# EasyEDA Pro project ProProject_STM32F407IGT6_2024-02-27.epro, schematic Schematic3
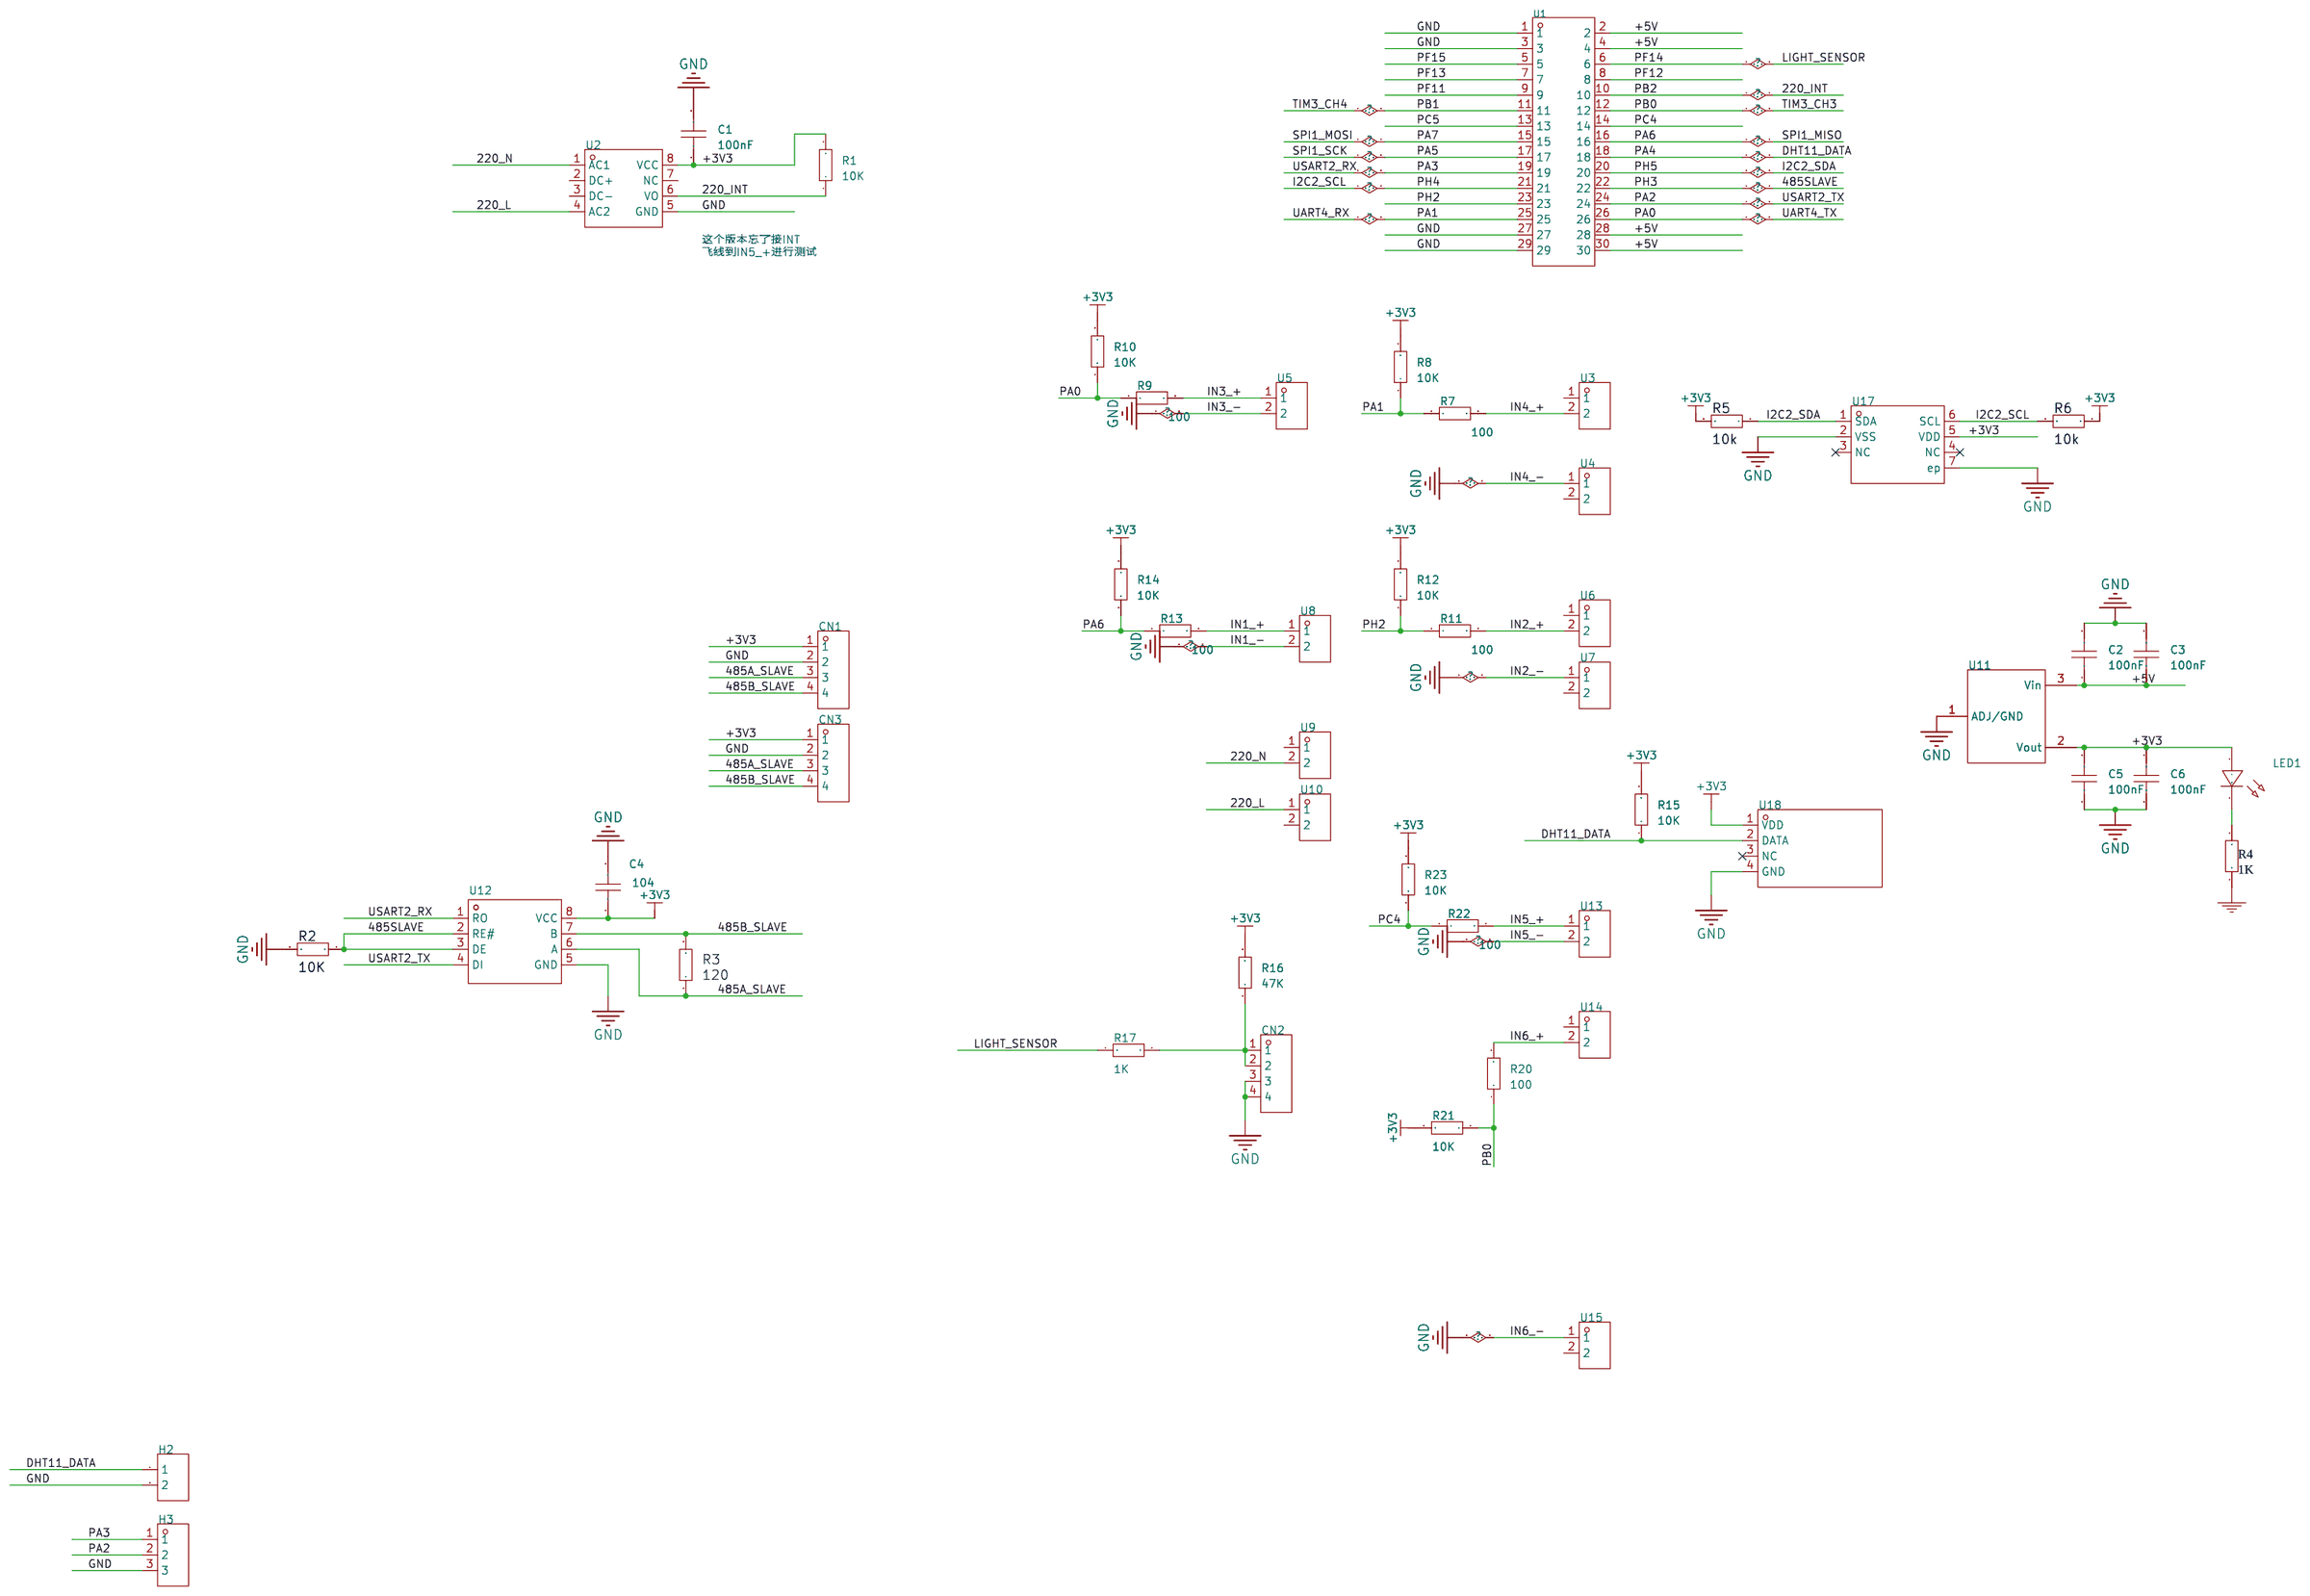
[diagram p3: schematic sheet]

## Parts
C1  100nF  [C0805]
C2  100nF  [C0805]
C3  100nF  [C0805]
C4  104  [C0805]
C5  100nF  [C0805]
C6  100nF  [C0805]
CN1  HC-5264-4A  [CONN-TH_4P-P2.50_HCTL_HC-5264-4A]
CN2  XH-4AK  [CONN-TH_XH-4AK]
CN3  HC-5264-4A  [CONN-TH_4P-P2.50_HCTL_HC-5264-4A]
H2  -  [HDR-TH_2P-P2.54-V-F]
H3  -  [HDR-TH_3P-P2.54-V-F]
LED1  -  [LED0805-RD_RED]
R1  10K  [R0805]
R2  10K  [R0805]
R3  120  [R0805]
R4  1K  [R0805]
R5  10k  [R0805]
R6  10k  [R0805]
R7  100  [R0805]
R8  10K  [R0805]
R9  100  [R0805]
R10  10K  [R0805]
R11  100  [R0805]
R12  10K  [R0805]
R13  100  [R0805]
R14  10K  [R0805]
R15  10K  [R0805]
R16  47K  [R0805]
R17  1K  [R0805]
R20  100  [R0805]
R21  10K  [R0805]
R22  100  [R0805]
R23  10K  [R0805]
U1  ZX-IDC2.54-2-15PZZ  [IDC-TH_30P-P2.54_ZX-IDC2.54-2-15PZZ]
U2  ACPL-K370-500E  [SO-8_L5.9-W6.8-P1.27-LS11.5-BL]
U3  KF7.62-2P  [CONN-TH_2P-P7.62_KEFA_KF7.62-2P]
U4  KF7.62-2P  [CONN-TH_2P-P7.62_KEFA_KF7.62-2P]
U5  KF7.62-2P  [CONN-TH_2P-P7.62_KEFA_KF7.62-2P]
U6  KF7.62-2P  [CONN-TH_2P-P7.62_KEFA_KF7.62-2P]
U7  KF7.62-2P  [CONN-TH_2P-P7.62_KEFA_KF7.62-2P]
U8  KF7.62-2P  [CONN-TH_2P-P7.62_KEFA_KF7.62-2P]
U9  KF7.62-2P  [CONN-TH_2P-P7.62_KEFA_KF7.62-2P]
U10  KF7.62-2P  [CONN-TH_2P-P7.62_KEFA_KF7.62-2P]
U11  UZ1085L-33-TN3-R  [TO-252-2_L6.6-W6.1-P4.58-TL]
U12  MAX3485EESA+T  [SOIC-8_L4.9-W3.9-P1.27-LS6.0-BL]
U13  KF7.62-2P  [CONN-TH_2P-P7.62_KEFA_KF7.62-2P]
U14  KF7.62-2P  [CONN-TH_2P-P7.62_KEFA_KF7.62-2P]
U15  KF7.62-2P  [CONN-TH_2P-P7.62_KEFA_KF7.62-2P]
U17  SHT20-TR-1.5KS  [DFN-6_L3.0-W3.0-P0.95-TR-EP]
U18  DHT11  [SENSOR-TH_DHT11]

## Library data of the parts
C1-C3 C5 C6 = CAP_0805: Supplier Footprint: 0805
C4 = CAP_0805: 容值:100nF;精度:±10%;额定电压:50V;温度系数:X7R;; Supplier Footprint: 0805
CN1 CN3 = HC-5264-4A: 插针结构:1x4P;间距:2.5mm;安装方式:直插;行距:-;总PIN数:4P;排数:1;每排PIN数:4;参考系列:-;额定电流:3A;工作温度范围:-25℃~+85℃;; LCSC Part Name: 1x4P 间距:2.5mm 直插; Supplier Part: C2845816; Manufacturer: HCTL(华灿天禄); Supplier Footprint: 插件,P=2.5mm; JLCPCB Part Class: 扩展库; Datasheet: https://atta.szlcsc.com/upload/public/pdf/source/20231019/713AA42E7B1E6A6BC6D4E561F769D95F.pdf; Supplier: LCSC; Pins Structure: 1x4P; Pitch: 2.5mm; Mounting Style: 直插; Number of Pins: 4P; Number of Rows: 1; Number of PINs Per Row: 4; Current Rating (Max): 3A; Operating Temperature Range: -25℃~+85℃
CN2 = XH-4AK: 插针结构:1x4P;间距:2.5mm;公母:公;安装方式:直插;行距:-;排数:1;每排PIN数:4;参考系列:-;额定电流:2A;工作温度范围:-25℃~+85℃;; LCSC Part Name: 1x4P 间距:2.5mm 直插; Supplier Part: C722871; Manufacturer: CAX(创都); Supplier Footprint: 插件,P=2.5mm; JLCPCB Part Class: Extended Part; Datasheet: https://atta.szlcsc.com/upload/public/pdf/source/20200903/C722871_BEC659A202DD5B5008316291EC89367F.pdf; Supplier: LCSC; Pins Structure: 1x4P; Pitch: 2.5mm; Gender: 公; Mounting Style: 直插; Number of Rows: 1; Number of PINs Per Row: 4; Current Rating (Max): 2A; Operating Temperature Range: -25℃~+85℃
H2 = HDR-F_2.54_1x2P: Supplier Part: C49661; Supplier Footprint: 插件
H3 = HDR-F_2.54_1x3P: Supplier Part: C541850; Supplier Footprint: 插件
LED1 = LED_0805-G: Supplier Footprint: 0805
R1 R7-R17 R20-R23 = Res_0805: Supplier Footprint: 0805
R2 R3 R5 R6 = 10K
R4 = 1K: Published: 8-Jun-2000; LatestRevisionDate: 17-Jul-2002; LatestRevisionNote: Re-released for DXP Platform.; PackageReference: AXIAL-0.4; Publisher: Altium Limited
U1 = ZX-IDC2.54-2-15PZZ: 连接器类型:简牛座;间距:2.54mm;结构:2x15P;额定电流:3A;额定电压:1kV;封装形式:直插;行距:2.54mm;排数:2;每排PIN数:15;触头材质:黄铜;触头镀层:金;工作温度范围:-40℃~+105℃;焊接温度(最大值):260℃@10S;; LCSC Part Name: 2.54mm 2x15P 排数:2 每排P数:15; Supplier Part: C7501248; Manufacturer: Megastar(兆星); Supplier Footprint: 插件,P=2.54mm; Datasheet: https://atta.szlcsc.com/upload/public/pdf/source/20231122/459F800AA0F2D58DBB272BCD842D4D41.pdf; Supplier: LCSC; Connector Type: 简牛座; Pitch: 2.54mm; Structure: 2x15P; Current Rating (Max): 3A; Voltage Rating (Max): 1kV; Holder Type: 直插; Row Spacing: 2.54mm; Number of Rows: 2; Pin Number in each Row: 15; Contact Material: 黄铜; Contact Plating: 金; Operating Temperature Range: -40℃~+105℃; Soldering Temperature(Max): 260℃@10S
U2 = ACPL-K370-500E: LCSC Part Name: Isolated Voltage/Current Detector; Supplier Part: C2977813; Manufacturer: Broadcom/AVAGO(安华高); Supplier Footprint: SO-8-6.8mm; JLCPCB Part Class: 扩展库; Datasheet: https://atta.szlcsc.com/upload/public/pdf/source/20220511/AB075B21B9194CFAB4C51F88C093740A.pdf; Supplier: LCSC
U3-U10 U13-U15 = KF7.62-2P_C5173665: LCSC Part Name: 绿色尼龙环保; Supplier Part: C5173665; Manufacturer: KEFA(科发); Supplier Footprint: 插件,P=7.62mm; JLCPCB Part Class: Extended Part; Datasheet: https://atta.szlcsc.com/upload/public/pdf/source/20220915/0842C98F0805CE3BBD42ED115252704B.pdf; Supplier: LCSC
U11 = UZ1085L-33-TN3-R: 输出类型:固定;最大输入电压:18V;输出电压:3.3V;最大输出电流:3A;电源纹波抑制比(PSRR):72dB@(120Hz);输出极性:正极;; LCSC Part Name: 输入18V 输出3.3V 3A; Supplier Part: C125622; Manufacturer: UTC(友顺); Supplier Footprint: TO-252-2(DPAK); JLCPCB Part Class: 扩展库; Datasheet: https://atta.szlcsc.com/upload/public/pdf/source/20180905/C281745_F796DDBD7FDDF6134D37DF1C5154ADDE.pdf; Supplier: LCSC; Output Type: 固定; Maximum Input Voltage: 18V; Output Voltage: 3.3V; MAX Output Current: 3A; Power Supply Rejection Ratio (PSRR): 72dB@(120Hz); Dropout Voltage: 1.4V@(3A); Output Polarity: 正极; Number of Outputs: 1
U12 = MAX3485EESA+T: 类型:收发器;驱动器/接收器:1/1;数据速率:12Mbps;; LCSC Part Name: 3.3V供电 12Mbps 收发器; Supplier Part: C9943; Manufacturer: ADI(亚德诺)/MAXIM(美信); Supplier Footprint: SOP-8; JLCPCB Part Class: Extended Part; Datasheet: https://atta.szlcsc.com/upload/public/pdf/source/20121117/1457706559058.pdf; Supplier: LCSC; Types: 收发器; Driver/receiver: 1/1; Data Rate: 12Mbps; Supply Voltage: 3V~3.6V; Operating Temperature: -40℃~+85℃
U17 = SHT20-TR-1.5KS: 1-100706-01, I2C接口，数字式温湿度传感器，电压范围: 2.1至3.6 V; Supplier Part: C53865; Manufacturer: Sensirion(瑞士盛思锐); Supplier Footprint: DFN-6-EP(3x3); JLCPCB Part Class: 扩展库; Datasheet: https://atta.szlcsc.com/upload/public/pdf/source/20151012/1457707445424.pdf; Supplier: LCSC
U18 = DHT11: 新款电容式数字温湿度传感器,老款已停产16.1x12.6x5.8mm; LCSC Part Name: DHT11  电容式传感器; Supplier Part: C117051; Manufacturer: 广州奥松; Supplier Footprint: SIP-4; JLCPCB Part Class: 扩展库; Datasheet: https://atta.szlcsc.com/upload/public/pdf/source/20170703/1499081238365.pdf; Supplier: LCSC

## Nets
+3V3: C1.1 C4.1 C5.2 C6.2 CN1.1 CN3.1 LED1.2(A) R1.2 R5.2 R6.2 R8.2 R10.2 R12.2 R14.2 R15.2 R16.2 R21.2 R23.2 U2.8(VCC) U11.2(Vout) U12.8(VCC) U17.5(VDD) U18.1(VDD)
+5V: C2.1 C3.1 U1.2 U1.4 U1.28 U1.30 U11.3(Vin)
GND: C1.2 C2.2 C3.2 C4.2 C5.1 C6.1 CN1.2 CN2.3 CN2.4 CN3.2 H2.2 H3.3 R2.1 R4.2 U1.1 U1.3 U1.27 U1.29 U2.5(GND) U4.1 U5.2 U7.1 U8.2 U11.1(ADJ/GND) U12.5(GND) U13.2 U15.1 U17.2(VSS) U17.7(ep) U18.4(GND)
220_INT: R1.1 U1.10 U2.6(VO)
220_L: U2.4(AC2) U10.1
220_N: U2.1(AC1) U9.2
485A_SLAVE: CN1.3 CN3.3 R3.1 U12.6(A)
485B_SLAVE: CN1.4 CN3.4 R3.2 U12.7(B)
485SLAVE: R2.2 U1.22 U12.2(RE#) U12.3(DE)
DHT11_DATA: H2.1 R15.1 U1.18 U18.2(DATA)
I2C2_SCL: R6.1 U1.21 U17.6(SCL)
I2C2_SDA: R5.1 U1.20 U17.1(SDA)
IN1_+: R13.2 U8.1
IN2_+: R11.2 U6.2
IN3_+: R9.2 U5.1
IN4_+: R7.2 U3.2
IN5_+: R22.2 U13.1
IN6_+: R20.2 U14.2
LIGHT_SENSOR: R17.2 U1.6
PA0: R9.1 R10.1 U1.26
PA1: R7.1 R8.1 U1.25
PA2: H3.2 U1.24 U12.4(DI)
PA3: H3.1 U1.19 U12.1(RO)
PA5: U1.17
PA6: R13.1 R14.1 U1.16
PA7: U1.15
PB0: R20.1 R21.1 U1.12
PB1: U1.11
PC4: R22.1 R23.1 U1.14
PC5: U1.13
PF11: U1.9
PF12: U1.8
PF13: U1.7
PF15: U1.5
PH2: R11.1 R12.1 U1.23
$1N5460: LED1.1(C) R4.1
$1N7734: CN2.1 CN2.2 R16.1 R17.1

Not connected (* = marked no-connect by the designer): U2 2(DC+) 3(DC-) 7(NC); U3 1; U4 2; U6 1; U7 2; U9 1; U10 2; U14 1; U15 2; U17 3(NC)* 4(NC)*; U18 3(NC)*

## Notes on the sheet
- 这个版本忘了接INT
  飞线到IN5_+进行测试
